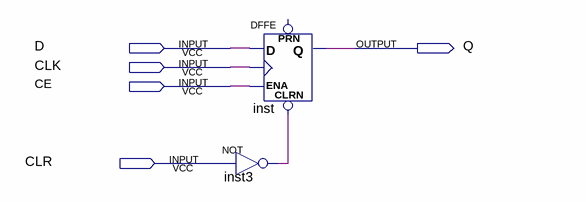
[diagram p0: schematic sheet]
// Quartus schematic D_FF_CE_AC.bdf as structural Verilog: 2 symbols, 5 pins
module D_FF_CE_AC (
  input  D,
  input  CLK,
  input  CE,
  input  CLR,
  output Q
);

  wire inst3_out;

  DFFE inst (.CLRN(inst3_out), .D(D), .CLK(CLK), .ENA(CE), .Q(Q));  // open: PRN
  not inst3 (inst3_out, CLR);
endmodule
